# Altium schematic sheet LED.SchDoc: <title>
size A4; Organization: Institut d'Automatisation Industrielle; SheetNumber: 1; SheetTotal: 3; SVN: OUI; CurrentTime: 6; CurrentDate: 5; DocumentFullPathAndName: 8; DocumentName: 9; ModifiedDate: 13; ProjectName: <projet>
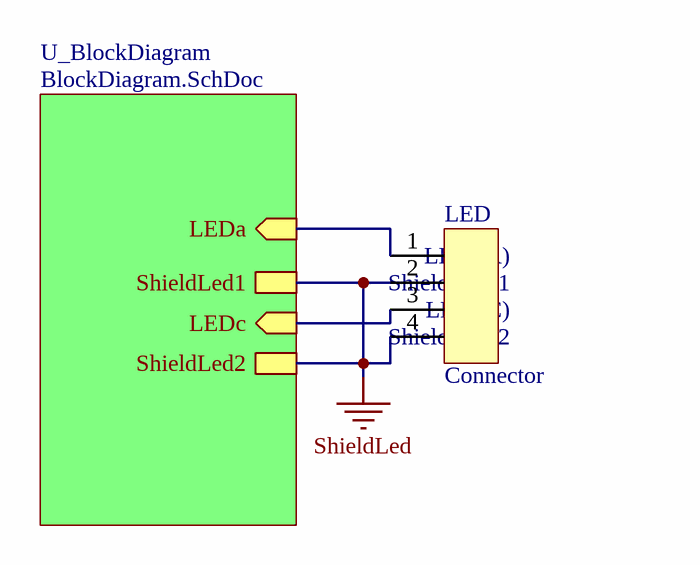
[diagram p0: LED.SchDoc]

## Parts
LED  System: Connector  [MicroMatch4p]  (hidden comment: LED)

## Sub-sheets
U_BlockDiagram = BlockDiagram.SchDoc: LEDa (in), LEDc (in), ShieldLed1, ShieldLed2

## Nets
ShieldLed: LED.2 LED.4 ; sheet U_BlockDiagram/ShieldLed1, sheet U_BlockDiagram/ShieldLed2
NetLED_1: LED.1 ; sheet U_BlockDiagram/LEDa
NetLED_3: LED.3 ; sheet U_BlockDiagram/LEDc

## Notes on the sheet
- (near LED) LED (C)
- (near LED) Shield_Led1
- (near LED) LED (A)
- (near LED) Shield_Led2
- Title
- Institut d'automatisation industrielle
  rte de Cheseaux 1
  CH-1401 Yverdon-les-Bains
  T +41(0)24 55 77 377    F +41(0)24 55 76 320
  http://iai.heig-vd.ch       iai@heig-vd.ch
- Date:
- Size:
- A4
- Project:
- Sheet
- of
- No.
- Author:
- SVN
- Version
- File:

## Library data of the parts
LED = MicroMatch4p: Supplier 1: Digi-Key; Supplier Part Number 1: A107022CT-ND